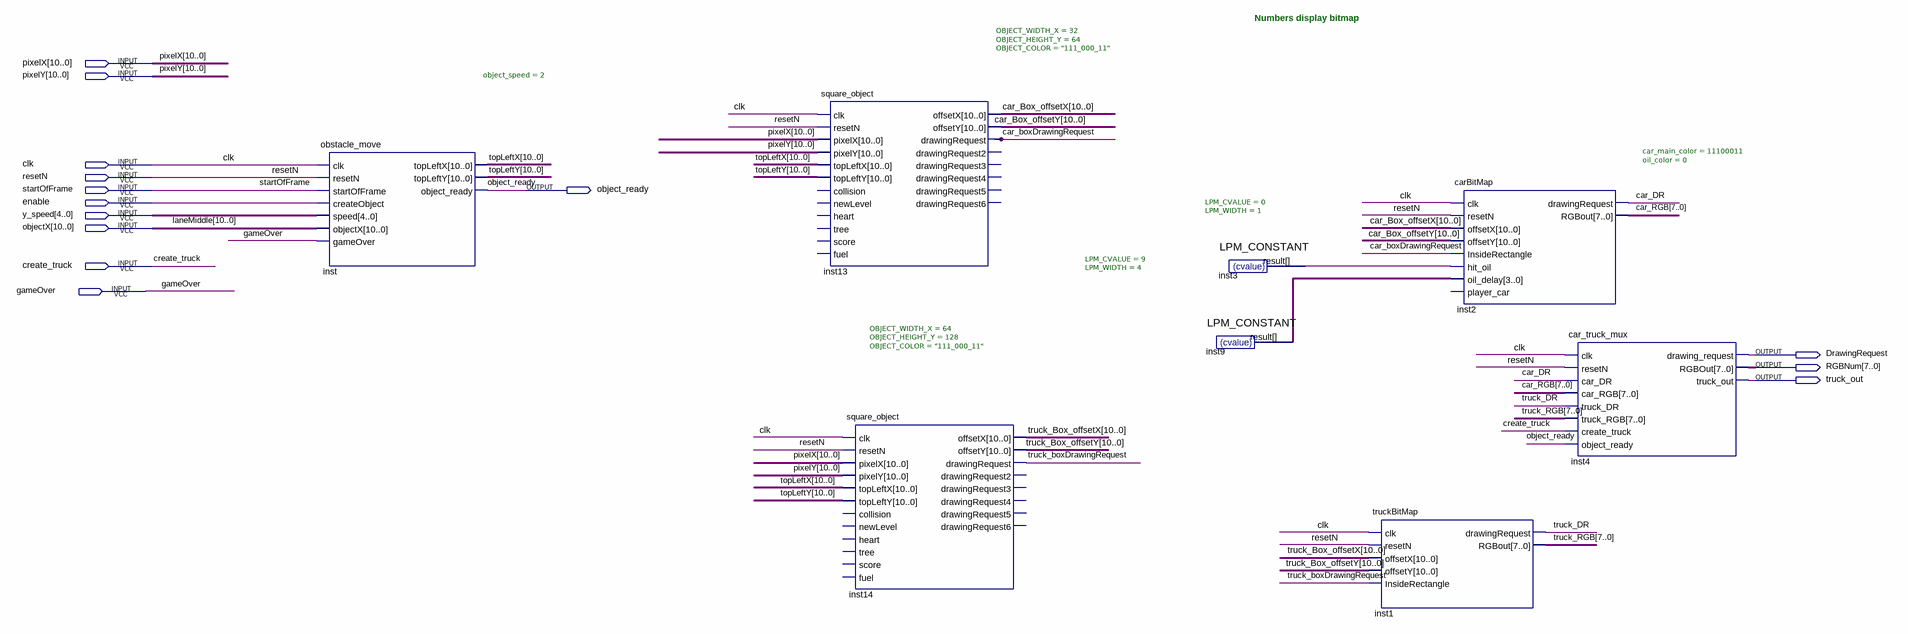
[diagram p0: schematic sheet]
// Quartus schematic Obstacle_block.bdf as structural Verilog: 8 symbols, 14 pins
module Obstacle_block (
  input  [10:0] pixelX,
  input  [10:0] pixelY,
  input  clk,
  input  resetN,
  input  startOfFrame,
  input  enable,
  input  [4:0] y_speed,
  input  [10:0] objectX,
  input  create_truck,
  input  gameOver,
  output object_ready,
  output DrawingRequest,
  output [7:0] RGBNum,
  output truck_out
);

  wire car_boxDrawingRequest, car_DR, inst3_result, truck_boxDrawingRequest, truck_DR;
  wire [3:0] inst9_result;
  wire [7:0] car_RGB, truck_RGB;
  wire [10:0] car_Box_offsetX, car_Box_offsetY, topLeftX, topLeftY, truck_Box_offsetX, truck_Box_offsetY;

  obstacle_move #(.object_speed(2)) inst (
    .clk(clk), .resetN(resetN), .startOfFrame(startOfFrame), .createObject(enable), .speed(y_speed),
    .objectX(objectX), .gameOver(gameOver), .topLeftX(topLeftX), .topLeftY(topLeftY),
    .object_ready(object_ready));
  square_object #(.OBJECT_WIDTH_X(32), .OBJECT_HEIGHT_Y(64), .OBJECT_COLOR("111_000_11")) inst13 (
    .clk(clk), .resetN(resetN), .pixelX(pixelX), .pixelY(pixelY), .topLeftX(topLeftX), .topLeftY(topLeftY),
    .offsetX(car_Box_offsetX), .offsetY(car_Box_offsetY), .drawingRequest(car_boxDrawingRequest));  // open: collision, newLevel, heart, tree, score, fuel, drawingRequest2, drawingRequest3, drawingRequest4, drawingRequest5, drawingRequest6
  square_object #(.OBJECT_WIDTH_X(64), .OBJECT_HEIGHT_Y(128), .OBJECT_COLOR("111_000_11")) inst14 (
    .clk(clk), .resetN(resetN), .pixelX(pixelX), .pixelY(pixelY), .topLeftX(topLeftX), .topLeftY(topLeftY),
    .offsetX(truck_Box_offsetX), .offsetY(truck_Box_offsetY), .drawingRequest(truck_boxDrawingRequest));  // open: collision, newLevel, heart, tree, score, fuel, drawingRequest2, drawingRequest3, drawingRequest4, drawingRequest5, drawingRequest6
  LPM_CONSTANT #(.LPM_CVALUE(9), .LPM_WIDTH(4)) inst9 (.result(inst9_result));
  LPM_CONSTANT #(.LPM_CVALUE(0), .LPM_WIDTH(1)) inst3 (.result(inst3_result));
  truckBitMap inst1 (
    .clk(clk), .resetN(resetN), .offsetX(truck_Box_offsetX), .offsetY(truck_Box_offsetY),
    .InsideRectangle(truck_boxDrawingRequest), .drawingRequest(truck_DR), .RGBout(truck_RGB));
  carBitMap #(.car_main_color(11100011), .oil_color(0)) inst2 (
    .clk(clk), .resetN(resetN), .offsetX(car_Box_offsetX), .offsetY(car_Box_offsetY),
    .InsideRectangle(car_boxDrawingRequest), .hit_oil(inst3_result), .oil_delay(inst9_result),
    .drawingRequest(car_DR), .RGBout(car_RGB));  // open: player_car
  car_truck_mux inst4 (
    .clk(clk), .resetN(resetN), .car_DR(car_DR), .car_RGB(car_RGB), .truck_DR(truck_DR),
    .truck_RGB(truck_RGB), .create_truck(create_truck), .object_ready(object_ready),
    .drawing_request(DrawingRequest), .RGBOut(RGBNum), .truck_out(truck_out));

  // Other names for the same wires on the sheet: laneMiddle[10:0] = objectX

  // Notes on the sheet:
  //   Numbers display bitmap
endmodule
